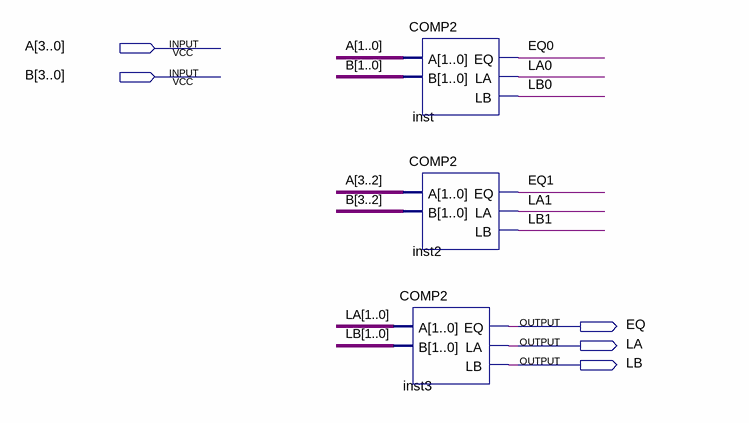
[diagram p0: schematic sheet]
// Quartus schematic COMP4.bdf as structural Verilog: 3 symbols, 5 pins
module COMP4 (
  input  [3:0] A,
  input  [3:0] B,
  output EQ,
  output LA,
  output LB
);

  wire EQ0, EQ1;
  wire [1:0] LA_bus, LB_bus;

  COMP2 inst (.A(A[1:0]), .B(B[1:0]), .EQ(EQ0), .LA(LA_bus[0]), .LB(LB_bus[0]));
  COMP2 inst2 (.A(A[3:2]), .B(B[3:2]), .EQ(EQ1), .LA(LA_bus[1]), .LB(LB_bus[1]));
  COMP2 inst3 (.A(LA_bus), .B(LB_bus), .EQ(EQ), .LA(LA), .LB(LB));
endmodule
